# Altium schematic sheet Power Supply.SchDoc
size A
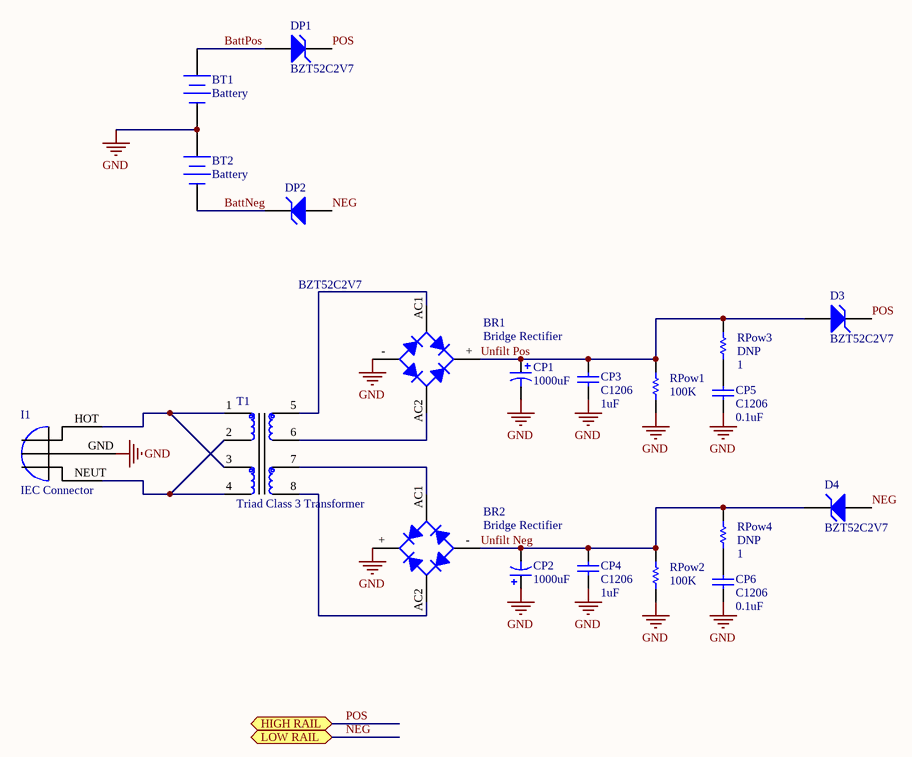
[diagram p0: Power Supply.SchDoc]

## Parts
BR1  Bridge Rectifier  [Bridge Rectifier]
BR2  Bridge Rectifier  [Bridge Rectifier]
BT1  Battery  [BAT-2]
BT2  Battery  [BAT-2]
CP1  1000uF  [CAPPR7.5-16X25]
CP2  1000uF  [CAPPR7.5-16X25]
CP3  C1206  value 1uF  [1206]
CP4  C1206  value 1uF  [1206]
CP5  C1206  value 0.1uF  [1206]
CP6  C1206  value 0.1uF  [1206]
D3  BZT52C2V7  [SOD-123]
D4  BZT52C2V7  [SOD-123]
DP1  BZT52C2V7  [SOD-123]
DP2  BZT52C2V7  [SOD-123]
I1  IEC Connector  [IEC Connector]
RPow1  100K  [ERA-0805]
RPow2  100K  [ERA-0805]
RPow3  DNP  value 1  [ERA-0805]
RPow4  DNP  value 1  [ERA-0805]
T1  Triad Class 3 Transformer  [TRIAD CLASS 3 TRANSFORMER]

## Ports
HIGH RAIL, LOW RAIL

## Nets
GND: BR1.- BR2.+ BT1.2(-) BT2.1(+) CP1.2 CP2.1 CP3.1 CP4.1 CP5.1 CP6.1 I1.GND RPow1.1 RPow2.1
BattNeg: BT2.2(-) DP2.2(K)
BattPos: BT1.1(+) DP1.1(A)
NEG: D4.1(A) DP2.1(A) ; port LOW RAIL
POS: D3.2(K) DP1.2(K) ; port HIGH RAIL
Unfilt Neg: BR2.- CP2.2 CP4.2 D4.2(K) RPow2.2 RPow4.2
Unfilt Pos: BR1.+ CP1.1 CP3.2 D3.1(A) RPow1.2 RPow3.2
NetBR1_AC1: BR1.AC1 T1.5
NetBR1_AC2: BR1.AC2 T1.6
NetBR2_AC1: BR2.AC1 T1.7
NetBR2_AC2: BR2.AC2 T1.8
NetCP5_2: CP5.2 RPow3.1
NetCP6_2: CP6.2 RPow4.1
NetI1_HOT: I1.HOT T1.1 T1.3
NetI1_NEUT: I1.NEUT T1.2 T1.4

## Library data of the parts
BT1 BT2 = Battery: Multicell Battery; Published: 24-Mar-1999; LatestRevisionDate: 17-Jul-2002; LatestRevisionNote: Re-released for DXP Platform.; PackageReference: BAT-2; Publisher: Altium Limited; PackageDescription: Battery; 2 Leads
CP1 CP2 = EKA00JG247O00: Aluminum Electrolytic Capacitor, Radial Style with Long Leads: 47uF, 350V; Note: Refer to Manufacturer's Data Sheets for other lead formations; DrillSize: Nominal, Rounded To The Nearest 0.1mm; Published: 19-Mar-2004; DatasheetDocument: 20-Feb-2001; PackageReference: CAPPR7.5-16X25; Publisher: Altium Limited; ComponentLink1Description: Manufacturer Link; ComponentLink1URL: http://www.vishay.com/; ComponentLink2Description: Datasheet; ComponentLink2URL: http://www.vishay.com/docs/25014/eka.pdf; Value: 1000uF
CP3-CP6 = C1206: Ceramic Chip Capacitor - Standard; Published: 17-Jul-2002; LatestRevisionDate: 19-Mar-2004; LatestRevisionNote: Silkscreen size reduced.; DatasheetDocument: Mar-2001; PackageDocument: Mar-2001; PackageReference: 1206; Publisher: Altium Limited; Code_JEITA: 1206; Code_IPC: 3216 [1206]; ComponentLink1Description: Manufacturer Link; ComponentLink1URL: http://www.kemet.com/; ComponentLink2Description: Datasheet; ComponentLink2URL: http://www.kemet.com/kemet/web/homepage/kechome.nsf/vapubfilesname/F3102TA.pdf/$file/F3102TA.pdf
D3 D4 DP1 DP2 = BZT52C2V7: Surface Mount Zener Diode; Published: 8-Jun-2000; LatestRevisionDate: 17-Jul-2002; LatestRevisionNote: Re-released for DXP Platform.; DatasheetDocument: REV. L-2; PackageReference: SOD-123; Publisher: Altium Limited; ComponentLink1Description: Manufacturer Link; ComponentLink1URL: http://www.vishay.com/
RPow1-RPow4 = ERA6Y: Rectangular Thick Film Chip Resistor, 10 Ohm to 1M Ohm Range, 0.1% and 0.5% Tolerance, 0805 Size, 0.1 W; Note: If flow soldering, adjust pad width of PCB Footprint to 0.7 - 0.8 times the width of the resistor.; Published: 17-Dec-2003; LatestRevisionDate: 19-Mar-2004; LatestRevisionNote: Silkscreen size reduced.; PackageDocument: Mar-2003; PackageReference: ERA-0805; Publisher: Altium Limited; Code_IPC: 2012 [0805]; ComponentLink1Description: Manufacturer Link; ComponentLink1URL: http://www.panasonic.com/industrial/components/resistive_products.htm; ComponentLink2Description: Datasheet; ComponentLink2URL: http://www.panasonic.com/industrial/components/pdf/AOA0000CE8.pdf
  RPow1 RPow2: Value: 100K
  RPow3 RPow4: DNP: DNP
BR1 BR2 = Bridge Rectifier: Component Datasheet: http://www.diodes.com/_files/datasheets/ds21225.pdf; Component Link: http://www.digikey.com/product-detail/en/diodes-incorporated/GBU404/GBU404DI-ND/278605
I1 = IEC Connector: Component Datasheet: http://www.qualtekusa.com/Catalog/AC_Receptacles/pdfs/703w0053.pdf; Component Link: http://www.digikey.com/product-detail/en/qualtek/703W-00-53/Q219-ND/245560